# EAGLE design untitled (EAGLE 4.16)
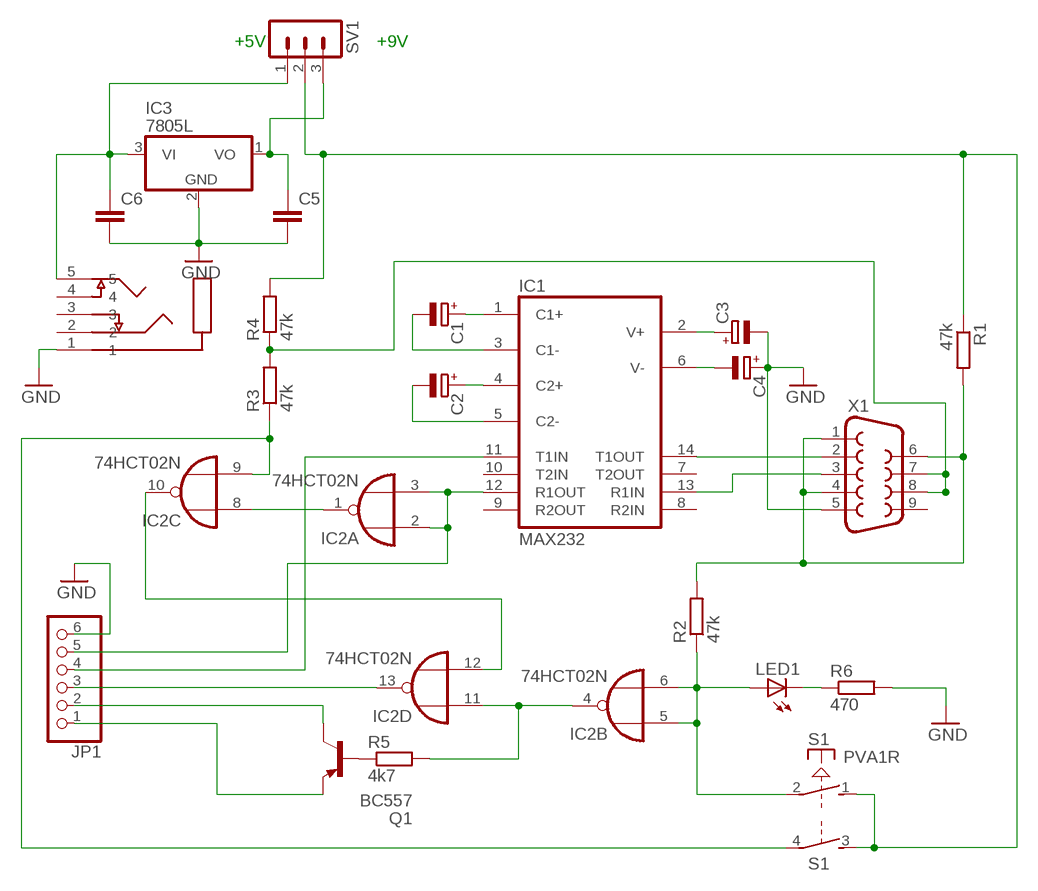
[diagram p0: schematic, sheet 1]

## Parts
C1  CPOL-EUE2.5-6  [E2,5-6]
C2  CPOL-EUE2.5-6  [E2,5-6]
C3  CPOL-EUE2.5-6  [E2,5-6]
C4  CPOL-EUE2.5-6  [E2,5-6]
C5  C-EU025-025X050  [C025-025X050]
C6  C-EU025-025X050  [C025-025X050]
IC1  MAX232  [DIL16]
IC2  74HCT02N  [DIL14]
IC3  7805L  [TO92]
JP1  PINHD-1X6  [1X06]
LED1  LED3MM  [LED3MM]
Q1  BC557  [TO92]
R1  47k  R-EU_0207/10  [0207/10]
R2  47k  R-EU_0207/10  [0207/10]
R3  47k  R-EU_0207/10  [0207/10]
R4  47k  R-EU_0207/10  [0207/10]
R5  4k7  R-EU_0207/10  [0207/10]
R6  470  R-EU_0207/10  [0207/10]
S1  PVA1R  [PVA1R]
SV1  MA03-1  [MA03-1]
U$1  KLINKENBUCHSE3,5MMSTEREO  [KLINKE3,5MMSTEREO]
X1  F09H  [F09H]

## Nets
GND: C3.- C4.+ C5.2 C6.2 IC3.2(GND) JP1.6 R6.2 U$1.1 X1.5
N$2: IC1.14(T1OUT) X1.2
N$3: IC1.13(R1IN) X1.3
N$4: C1.+ IC1.1(C1+)
N$5: C1.- IC1.3(C1-)
N$6: C2.+ IC1.4(C2+)
N$7: C2.- IC1.5(C2-)
N$8: C3.+ IC1.2(V+)
N$9: C4.- IC1.6(V-)
N$11: IC2.5(B:I0) IC2.6(B:I1) LED1.A R2.1 S1.2(1:P)
N$12: IC2.4(B:O) IC2.11(D:I0) R5.2
N$13: IC1.12(R1OUT) IC2.2(A:I0) IC2.3(A:I1) JP1.5
N$14: IC2.1(A:O) IC2.8(C:I0)
N$15: R3.2 R4.1 X1.7 X1.8
N$16: IC2.9(C:I1) R3.1 S1.4(2:P)
N$17: IC2.10(C:O) IC2.12(D:I1)
N$18: IC2.13(D:O) JP1.3
N$19: LED1.K(C) R6.1
N$20: Q1.2(B) R5.1
N$21: JP1.1 Q1.1(E)
N$22: JP1.2 Q1.3(C)
N$23: IC1.11(T1IN) JP1.4
N$24: R1.2 R2.2 X1.1 X1.4 X1.6
N$25: C5.1 IC3.1(VO) SV1.3
VCC: R1.1 R4.2 S1.1(1:S) S1.3(2:S) SV1.2
VDD: C6.1 IC3.3(VI) SV1.1 U$1.5
Unconnected: IC1.7(T2OUT) IC1.8(R2IN) IC1.9(R2OUT) IC1.10(T2IN) U$1.2 U$1.3 U$1.4 X1.9

## Notes on the sheet
- +5V | +9V

## Power pins joined to a net without a drawn wire
GND: IC1.15(GND) IC2.7(P:GND)
VCC: IC1.16(VCC) IC2.14(P:VCC)

## Library data of the parts
C1-C4 = rcl:CPOL-EU: POLARIZED CAPACITOR, European symbol
C5 C6 = rcl:C-EU: CAPACITOR, European symbol
IC1 = maxim:MAX232: RS232 TRANSEIVER
IC2 = 74xx-eu:74*02: Quad 2-input NOR gate
IC3 = linear:78*: Positive VOLTAGE REGULATOR Source: http://cache.national.com/ds/LM/LM78L05.pdf http://www.fairchildsemi.com/ds/LM/LM7805.pdf
JP1 = pinhead:PINHD-1X6: PIN HEADER
LED1 = led:LED: LED OSRAM: - CHIPLED LG R971, LG N971, LY N971, LG Q971, LY Q971, LO R971, LY R971 LH N974, LH R974 LS Q976, LO Q976, LY Q976 LO Q996 - Hyper CHIPLED LW Q18S LB Q993, LB Q99A, LB R99A - SideLED LS A670, LO A670, LY A670, LG A670, LP A670 LB A673, LV A673, LT A673, LW A673 LH A674 LY A675 LS A676, LA A676, LO A676, LY A676, LW A676 LS A679, LY A679, LG A679 - Hyper Micro SIDELED® LS Y876, LA Y876, LO Y876, LY Y876 LT Y87S - SmartLED LW L88C, LW L88S LB L89C, LB L89S, LG L890 LS L89K, LO L89K, LY L89K LS L896, LA L896, LO L896, LY L896 - TOPLED LS T670, LO T670, LY T670, LG T670, LP T670 LSG T670, LSP T670, LSY T670, LOP T670, LYG T670 LG T671, LOG T671, LSG T671 LB T673, LV T673, LT T673, LW T673 LH T674 LS T676, LA T676, LO T676, LY T676, LB T676, LH T676, LSB T676, LW T676 LB T67C, LV T67C, LT T67C, LS T67K, LO T67K, LY T67K, LW E67C LS E67B, LA E67B, LO E67B, LY E67B, LB E67C, LV E67C, LT E67C LW T67C LS T679, LY T679, LG T679 LS T770, LO T770, LY T770, LG T770, LP T770 LB T773, LV T773, LT T773, LW T773 LH T774 LS E675, LA E675, LY E675, LS T675 LS T776, LA T776, LO T776, LY T776, LB T776 LHGB T686 LT T68C, LB T68C - Hyper Mini TOPLED® LB M676 - Mini TOPLED Santana® LG M470 LS M47K, LO M47K, LY M47K Source: http://www.osram.convergy.de - LUMILED® LXK2-PW12-R00, LXK2-PW12-S00, LXK2-PW14-U00, LXK2-PW14-V00 LXK2-PM12-R00, LXK2-PM12-S00, LXK2-PM14-U00 LXK2-PE12-Q00, LXK2-PE12-R00, LXK2-PE12-S00, LXK2-PE14-T00, LXK2-PE14-U00 LXK2-PB12-K00, LXK2-PB12-L00, LXK2-PB12-M00, LXK2-PB14-N00, LXK2-PB14-P00, LXK2-PB14-Q00 LXK2-PR12-L00, LXK2-PR12-M00, LXK2-PR14-Q00, LXK2-PR14-R00 LXK2-PD12-Q00, LXK2-PD12-R00, LXK2-PD12-S00 LXK2-PH12-R00, LXK2-PH12-S00 LXK2-PL12-P00, LXK2-PL12-Q00, LXK2-PL12-R00 Source: www.luxeon.com
Q1 = transistor-pnp:BC557: PNP Transistor
R1-R6 = rcl:R-EU_: RESISTOR, European symbol
S1 = switch-misc:PVA1R: ITT SWITCH
SV1 = con-lstb:MA03-1: PIN HEADER
U$1 = kubi:KLINKENBUCHSE3,5MMSTEREO
X1 = con-subd:F09: SUB-D

## Board
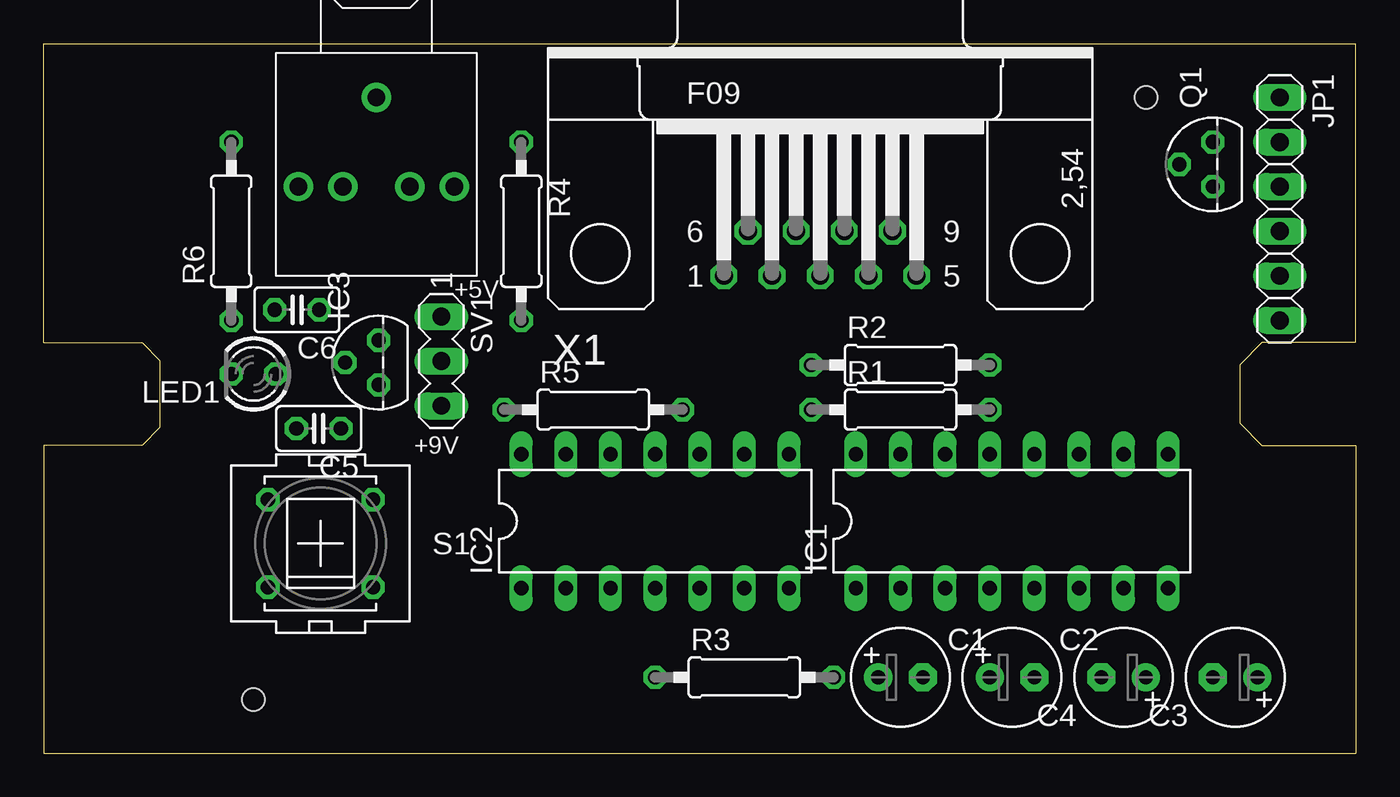
[diagram p1: board, top side]
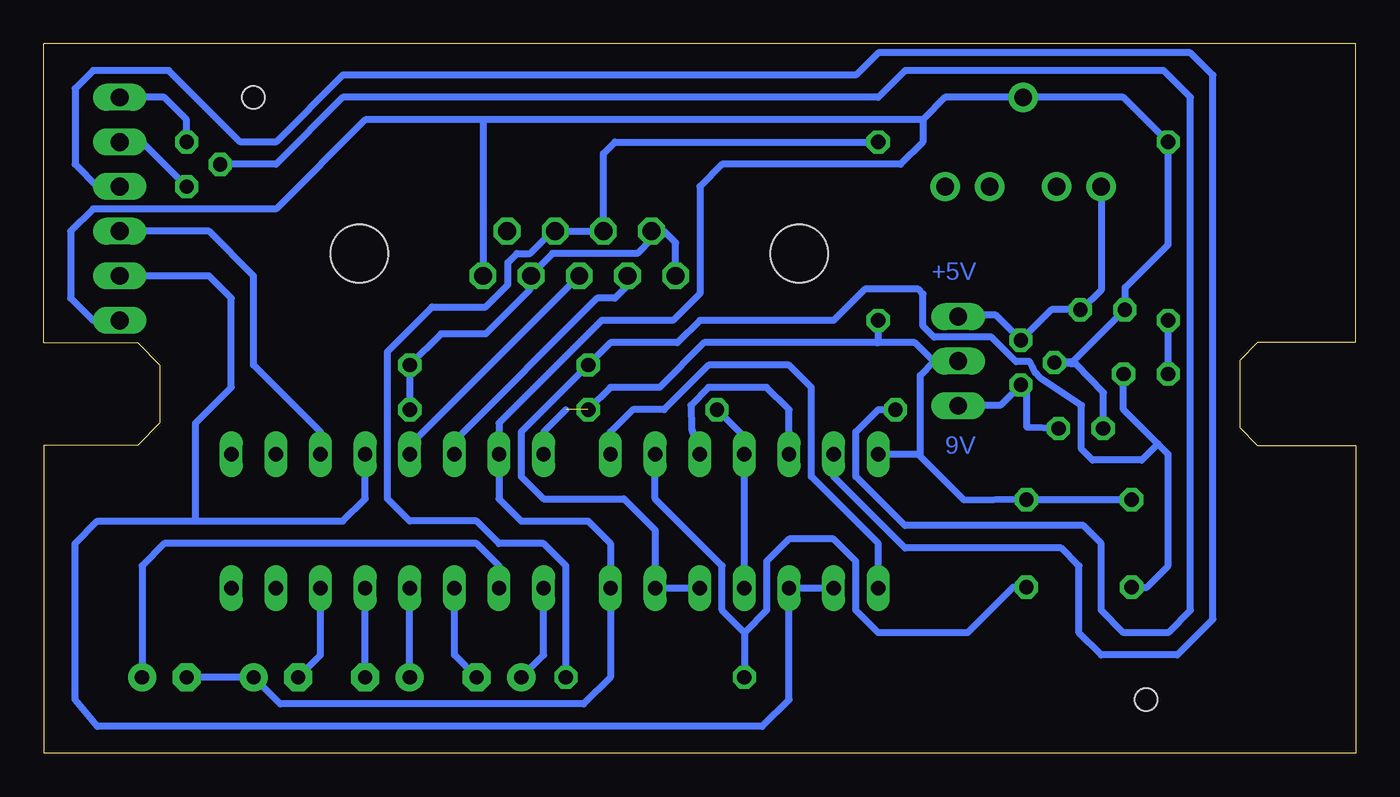
[diagram p2: board, bottom side, seen from below]

Size 74.68 x 40.39 mm. Coordinates in mm from the lower left corner, seen from the top.
Outline: 5.59,23.37 6.6,22.35 6.6,18.54 5.59,17.53 0,17.53 0,0 74.68,0 74.68,17.53 69.34,17.53 68.07,18.8 68.07,22.1 69.34,23.37 74.68,23.37 74.68,40.39 0,40.39 0,23.37 5.59,23.37
Copper layers (1*16): Top 0.035mm / dielectric 1.5mm / Bottom 0.035mm
Design rules "default": minimum track width 10mil, minimum drill 24mil, track to track 8mil, track to pad 8mil, pad to pad 8mil, via to via 8mil, smd to smd 8mil, copper to edge 40mil, drill to drill 8mil, minimum pad ring 10mil, minimum via ring 8mil, stop-mask expansion 4mil, vias tented up to drill 0mil, thermal gap 10mil
Holes 1.3 mm at 62.74,37.34 11.94,3.05

### Footprints (pad centres in the part's own frame; a part is rotated, then mirrored left to right if it is on the bottom)
E2,5-6 = drill 0.813 pad 1.6 round: + -1.27,0 | drill 0.813 pad 1.6 octagon: - 1.27,0
C025-025X050 = drill 0.813 octagon: 1 -1.27,0; 2 1.27,0
DIL16 = drill 0.813 long: 1 -8.89,-3.81; 2 -6.35,-3.81; 3 -3.81,-3.81; 4 -1.27,-3.81; 5 1.27,-3.81; 6 3.81,-3.81; 7 6.35,-3.81; 8 8.89,-3.81; 9 8.89,3.81; 10 6.35,3.81; 11 3.81,3.81; 12 1.27,3.81; 13 -1.27,3.81; 14 -3.81,3.81; 15 -6.35,3.81; 16 -8.89,3.81
DIL14 = drill 0.813 long: 1 -7.62,-3.81; 2 -5.08,-3.81; 3 -2.54,-3.81; 4 0,-3.81; 5 2.54,-3.81; 6 5.08,-3.81; 7 7.62,-3.81; 8 7.62,3.81; 9 5.08,3.81; 10 2.54,3.81; 11 0,3.81; 12 -2.54,3.81; 13 -5.08,3.81; 14 -7.62,3.81
TO92 = drill 0.813 octagon: 1 -1.27,0; 2 0,1.905; 3 1.27,0
1X06 = drill 1.016 long: 1 -6.35,0; 2 -3.81,0; 3 -1.27,0; 4 1.27,0; 5 3.81,0; 6 6.35,0
LED3MM = drill 0.813 octagon: A -1.27,0; K 1.27,0
TO92' = drill 0.813 octagon: 1 1.27,0; 2 0,1.905; 3 -1.27,0
0207/10 = drill 0.813 octagon: 1 -5.08,0; 2 5.08,0
PVA1R = drill 0.813 octagon: 1 -2.997,2.489; 2 -2.997,-2.489; 3 2.997,2.489; 4 2.997,-2.489
MA03-1 = drill 1.016 long: 1 -2.54,0; 2 0,0; 3 2.54,0
KLINKE3,5MMSTEREO = drill 1 pad 1.676 round: 1 2.54,5.715; 2 7.62,10.16; 3 7.62,7.62; 4 7.62,3.81; 5 7.62,1.27
F09H = drill 1.016 octagon: 1 -5.486,-1.27; 2 -2.743,-1.27; 3 0,-1.27; 4 2.743,-1.27; 5 5.486,-1.27; 6 -4.115,1.27; 7 -1.372,1.27; 8 1.372,1.27; 9 4.115,1.27 | hole 3.302: -12.522,0; 12.522,0

### Placement (x,y rotation side)
C1  48.77,4.32 0 top
C2  55.12,4.32 0 top
C3  67.82,4.32 180 top
C4  61.47,4.32 180 top
C5  15.64,18.48 180 top
C6  14.41,25.24 180 top
IC1  55.12,13.21 0 top
IC2  34.8,13.21 0 top
IC3  19.06,22.24 90 top
JP1  70.36,30.99 270 top
LED1  11.94,21.59 180 top
Q1  BC557  [TO92']  66.55,33.53 90 top
R1  48.77,19.56 0 top
R2  48.77,22.1 0 top
R3  39.88,4.32 0 top
R4  27.18,29.72 270 top
R5  31.27,19.56 0 top
R6  10.67,29.72 90 top
S1  15.75,11.94 0 top
SV1  22.63,22.32 270 top
U$1  13.21,39.88 270 top
X1  44.2,28.45 0 top

### Tracks (layer width: path | path; a pad name or v marks a point on that pad's centre or on a via)
GND
  Bottom 0.406: C3.- C4.+ 61.21,2.79 43.94,2.79 42.42,4.32 IC2.7 42.42,11.94 43.69,13.21 47.5,13.21 48.77,14.48 IC1.15 48.77,18.8 42.93,24.64 38.86,24.64 37.34,26.16 37.34,32.26 36.07,33.53 25.91,33.53 24.64,34.8 24.64,36.07 | JP1.6 71.88,24.64 73.15,25.91 73.15,29.72 71.88,30.99 61.47,30.99 56.39,36.07 49.78,36.07 | 24.64,36.07 49.78,36.07 | 19.56,37.34 13.21,37.34 R6.2 10.67,28.96 13.11,26.51 13.11,25.24 C6.2 16.09,22.29 17.15,22.29 IC3.2 15.91,22.13 14.35,20.53 14.35,18.97 C5.2 | 19.56,37.34 U$1.1 | 24.64,36.07 23.37,37.34 19.56,37.34 | X1.5 49.68,35.97 49.78,36.07
N$2
  Bottom 0.406: IC1.14 51.31,17.78 43.18,25.91 42.16,25.91 41.4,26.67 41.4,27.18 X1.2
N$3
  Bottom 0.406: IC1.13 53.85,17.53 X1.3
N$4
  Bottom 0.406: C1.+ 46.23,5.59 IC1.1
N$5
  Bottom 0.406: C1.- 51.31,5.59 IC1.3
N$6
  Bottom 0.406: C2.+ IC1.4
N$7
  Bottom 0.406: C2.- IC1.5
N$8
  Bottom 0.406: IC1.2 48.77,10.67 50.04,11.94 67.82,11.94 69.09,10.67 C3.+
N$9
  Bottom 0.406: C4.- 58.93,5.59 IC1.6
N$11
  Bottom 0.406: IC2.5 IC2.6 39.88,12.7 41.66,14.48 46.23,14.48 47.5,15.75 47.5,18.29 R2.1 42.42,23.37 38.61,23.37 37.34,24.64 29.72,24.64 27.94,26.42 24.89,26.42 24.62,26.15 24.62,24.31 24,23.69 20.73,23.69 19.33,22.29 18.55,22.29 18.4,21.98 18.24,21.67 17.93,21.36 | S1.2 11.89,9.45 10.67,10.67 10.67,17.02 11.26,17.61 | 11.26,17.61 13.21,19.56 LED1.A | 17.93,21.36 | 17.93,21.36 15.6,19.8 15.6,17.31 14.98,16.69 12.18,16.69 11.26,17.61 | 11.26,17.61 11.24,17.62
N$12
  Bottom 0.406: IC2.4 IC2.11 34.73,17.93 R5.2
N$13
  Bottom 0.406: JP1.5 65.28,27.18 64.01,25.91 64.01,20.83 66.04,18.8 66.04,13.21 | IC2.2 IC2.3 32.26,3.05 33.78,1.52 71.63,1.52 72.9,3.05 72.9,11.94 71.63,13.21 66.04,13.21 | IC1.12 56.39,14.48 57.66,13.21 66.04,13.21
N$14
  Bottom 0.406: IC2.8 42.42,18.29 41.15,19.56 39.37,19.56 36.83,22.1 32.26,22.1 30.99,20.83 30.99,15.75 27.18,11.94 IC2.1
N$15
  Bottom 0.406: R3.2 44.96,10.67 46.23,11.94 48.77,11.94 50.04,13.21 53.85,13.21 55.12,14.48 55.12,22.86 52.58,25.4 49.53,25.4 48.26,26.67 48.26,27.94 47.75,28.45 46.99,28.45 45.72,29.72 X1.8 X1.7 42.82,34.14 42.16,34.8 R4.1
N$16
  Bottom 0.406: IC2.9 39.88,14.48 36.07,10.67 36.07,8.13 34.8,6.86 | 34.8,6.86 33.53,8.13 33.53,10.92 32.26,12.19 29.72,12.19 28.45,10.92 28.45,8.13 27.18,6.86 22.1,6.86 19.51,9.45 S1.4 | 34.8,6.86 R3.1
N$17
  Bottom 0.406: IC2.10 37.8,18.47 37.85,19.8 36.85,20.83 33.53,20.83 32.26,19.56 IC2.12
N$18
  Bottom 0.406: IC2.13 29.72,15.75 25.65,11.68 16.76,11.68 15.75,10.67 15.75,6.86 14.48,5.59 10.16,5.59 8.13,7.62 8.13,38.61 9.4,39.88 27.18,39.88 28.45,38.61 57.66,38.61 61.47,34.8 63.5,34.8 67.56,38.86 71.88,38.86 72.9,37.85 72.9,33.53 71.63,32.26 JP1.3
N$19
  Bottom 0.406: LED1.K R6.1
N$20
  Bottom 0.406: R5.1 27.18,19.56 28.45,18.29 28.45,15.75 25.65,12.95 15.49,12.95 14.48,11.94 14.48,8.13 13.21,6.86 10.67,6.86 9.4,8.13 9.4,37.34 10.92,38.86 25.65,38.86 27.18,37.34 57.66,37.34 61.47,33.53 Q1.2
N$21
  Bottom 0.406: Q1.1 66.55,36.07 67.82,37.34 JP1.1
N$22
  Bottom 0.406: Q1.3 69.09,34.8 JP1.2
N$23
  Bottom 0.406: JP1.4 65.28,29.72 62.74,27.18 62.74,22.1 58.93,18.29 IC1.11
N$24
  Bottom 0.406: R1.2 R2.2 52.07,23.88 49.53,23.88 47.04,26.36 47.04,27.38 46.94,27.38 X1.4 46.99,27.18 45.72,28.45 40.89,28.45 40.08,29.26 X1.6 | X1.1 38.71,29.06 39.37,29.72 X1.6 | X1.6 40.13,29.72
N$25
  Bottom 0.406: C5.1 18.71,18.55 18.71,20.62 IC3.1 20.23,19.8 22.61,19.8 SV1.3
VCC  (1 unrouted)
  Bottom 0.406: S1.1 18.24,14.43 18.29,14.48 18.34,14.43 S1.3 18.8,14.48 22.3,14.43 24.89,17.02 | 24.89,17.02 24.78,17.02 | 24.89,17.02 IC2.14 | IC1.16 46.23,18.29 44.96,19.56 | 27.27,23.37 27.18,23.37 R4.2 | 27.27,23.37 37.08,23.37 39.62,20.83 42.42,20.83 R1.1 | SV1.2 22.66,22.29 24,22.29 | 27.27,23.37 27.27,23.38 25.09,23.38 24,22.29 | 24.78,17.02 24.78,17 | 24,22.29 24.78,21.51 24.78,17.02
VDD
  Bottom 0.406: SV1.1 22.6,24.89 22.6,24.93 20.48,24.93 IC3.3 17.31,25.24 C6.1 15.6,25.24 14.48,26.36 U$1.5

### Text on the board
Bottom: +5V | 9V
tPlace: +5V | +9V